# EasyEDA Pro project coreboards.mod001.rp2040.v01.eprj

# Schematic coreboards.mod001.rp2040.v01
Board Name: coreboards.mod001.rp2040.v01; Create Date: 2026-03-10; Page Name: coreboard; Project Name: coreboards.mod001.rp2040.v01; Schematic Name: coreboards.mod001.rp2040.v01; Update Date: 2026-03-13; Company: EasyEDA.com; Page Size: A4; Version: V1.0
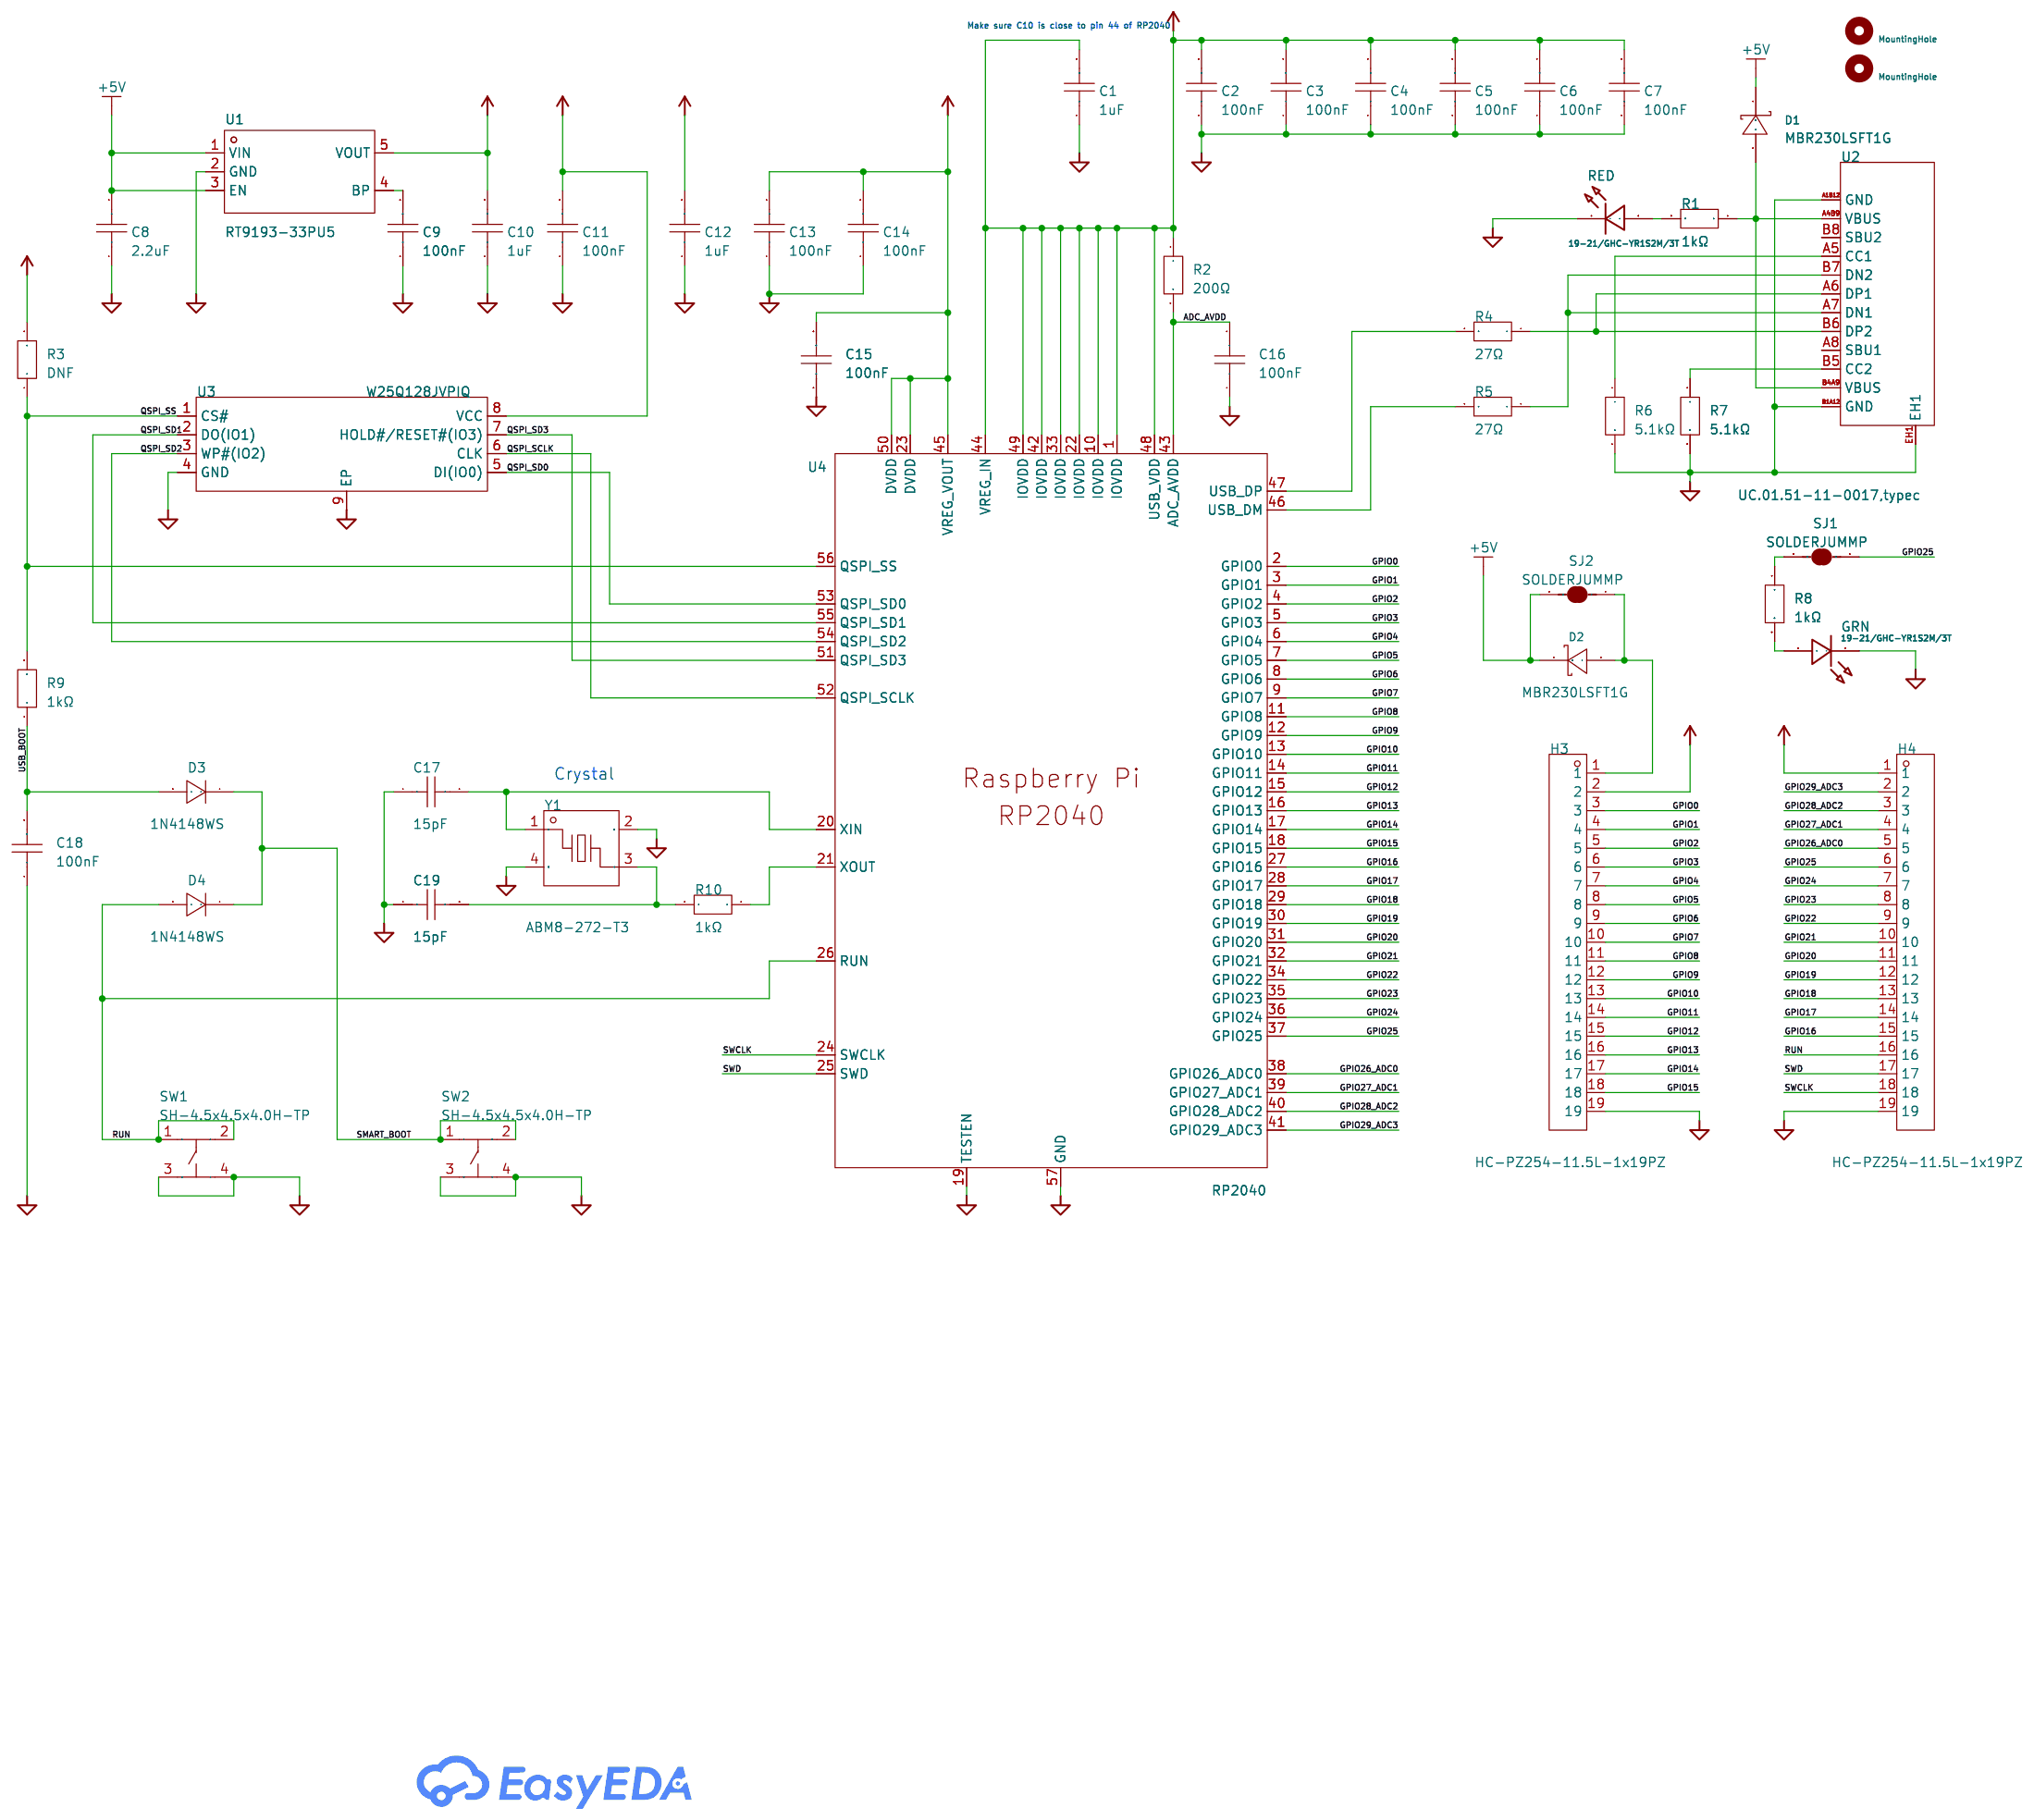
[diagram p0: schematic sheet]

## Parts
C1  1uF  [C0603]
C2  100nF  [C0603]
C3  100nF  [C0603]
C4  100nF  [C0603]
C5  100nF  [C0603]
C6  100nF  [C0603]
C7  100nF  [C0603]
C8  2.2uF  [C0603]
C9  100nF  [C0603]
C10  1uF  [C0603]
C11  100nF  [C0603]
C12  1uF  [C0603]
C13  100nF  [C0603]
C14  100nF  [C0603]
C15  100nF  [C0603]
C16  100nF  [C0603]
C17  15pF  [C0603]
C18  100nF  [C0603]
C19  15pF  [C0603]
D1  MBR230LSFT1G  [SOD-123FL_L2.7-W1.8-LS3.8-RD]
D2  MBR230LSFT1G  [SOD-123FL_L2.7-W1.8-LS3.8-RD]
D3  1N4148WS  [SOD-323_L1.8-W1.3-LS2.5-RD]
D4  1N4148WS  [SOD-323_L1.8-W1.3-LS2.5-RD]
GRN  19-21/GHC-YR1S2M/3T  [LED-SMD_L1.6-W0.8-RD]
H1  MountingHole  [MountingHole:MountingHole_2.7mm_M2.5]
H2  MountingHole  [MountingHole:MountingHole_2.7mm_M2.5]
H3  HC-PZ254-11.5L-1x19PZ  [HDR-TH_19P-P2.54-V-M]
H4  HC-PZ254-11.5L-1x19PZ  [HDR-TH_19P-P2.54-V-M]
R1  1kΩ  [R0603]
R2  200Ω  [R0603]
R3  DNF  [R0603]
R4  27Ω  [R0603]
R5  27Ω  [R0603]
R6  5.1kΩ  [R0603]
R7  5.1kΩ  [R0603]
R8  1kΩ  [R0603]
R9  1kΩ  [R0603]
R10  1kΩ  [R0603]
RED  19-21/GHC-YR1S2M/3T  [LED-SMD_L1.6-W0.8-RD]
SJ1  SOLDERJUMMP  [SJ_2S-NO]
SJ2  SOLDERJUMMP  [SJ_2S-NO]
SW1  SH-4.5x4.5x4.0H-TP  [SW-SMD_4P-SH-4.5X4.5X4.0H-TP]
SW2  SH-4.5x4.5x4.0H-TP  [SW-SMD_4P-SH-4.5X4.5X4.0H-TP]
U1  RT9193-33PU5  [SC-70-5_L2.0-W1.3-P0.65-LS2.1-BL]
U2  UC.01.51-11-0017,typec  [TYPE-C-SMD_UC.01.51-11-0017]
U3  W25Q128JVPIQ  [WSON-8_L5.0-W6.0-P1.27-BL-EP]
U4  RP2040  [QFN-56_L7.0-W7.0-P0.40-TL-EP4.0]
Y1  ABM8-272-T3  [CRYSTAL-SMD_4P-L3.2-W2.5-BL-2]

## Library data of the parts
C1-C19 = C0603C102J2GECAUTO: LCSC Part Name: 1nF ±5% 200V; Supplier Part: C2169812; Manufacturer: KEMET(基美); Supplier Footprint: 0603; JLCPCB Part Class: Extended Part; Datasheet: https://item.szlcsc.com/datasheet/C0603C102J2GECAUTO/2261877.html; Supplier: LCSC; Tolerance: ±5%; Voltage Rating: 200V; Temperature Coefficient: C0G
D1 D2 = MBR230LSFT1G: LCSC Part Name: 电压:30V 电流:2A; Supplier Part: C126673; Manufacturer: onsemi(安森美); Supplier Footprint: SOD-123FL; JLCPCB Part Class: Extended Part; Datasheet: https://item.szlcsc.com/datasheet/MBR230LSFT1G/137953.html; Supplier: LCSC; Voltage - Forward(Vf@If): 430mV@2A; Voltage - DC Reverse(Vr): 30V; Current - Rectified: 2A; Reverse Leakage Current (Ir): 1mA@30V; Operating Junction Temperature Range: -55℃~+125℃; Non-Repetitive Peak Forward Surge Current: 40A
D3 D4 = 1N4148WS_C2128: LCSC Part Name: 丝印T4 1N4148WS; Supplier Part: C2128; Manufacturer: CJ(江苏长电/长晶); Supplier Footprint: SOD-323; JLCPCB Part Class: Basic Part; Datasheet: https://item.szlcsc.com/datasheet/1N4148WS/2485.html; Supplier: LCSC; Diode Configuration: Independent; Voltage - Forward(Vf@If): 1.25V@150mA; Voltage - DC Reverse(Vr): 100V; Current - Rectified: 150mA; Pd - Power Dissipation: 200mW; Reverse Leakage Current (Ir): 1uA@75V; Reverse Recovery Time (trr): 4ns; Non-Repetitive Peak Forward Surge Current: 2A
GRN RED = 19-21/GHC-YR1S2M/3T: Supplier: LCSC; Supplier Part: C605453; Manufacturer: EVERLIGHT(亿光); JLCPCB Part Class: Extended Part; Contributor: LCSC; spicePre: L
H1 = Mechanical_MountingHole: Attribute1: H2
H2 = Mechanical_MountingHole
H3 H4 = HC-PZ254-11.5L-1x19PZ: LCSC Part Name: 1x19P 间距:2.54mm 方针 直插; Supplier Part: C27985198; Manufacturer: HC(虹成电子); Supplier Footprint: 插件,P=2.54mm; JLCPCB Part Class: Extended Part; Datasheet: https://item.szlcsc.com/datasheet/HC-PZ254-11.5L-1x19PZ/29721156.html; Supplier: LCSC; Pin Structure: 1x19P; Pitch: 2.54mm; Circluar Pins/Square Pins: Pin Header; Mounting Type: Through Hole; Number of Rows: 1; Number of Pins: 19P; Current Rating: 3A; Length of Mating Pin: 6mm; Insulation Height: 2.5mm; Length of End Connection Pin: 3mm; Contact Material: Brass; Contact Plating: Gold; Operating Temperature: -40℃~+105℃; Color: Black
R1-R10 = RCC06031K50FKEA: LCSC Part Name: 厚膜电阻 1.5kΩ ±1% 200mW; Supplier Part: C4303195; Manufacturer: VISHAY(威世); Supplier Footprint: 0603; JLCPCB Part Class: Extended Part; Datasheet: https://item.szlcsc.com/datasheet/RCC06031K50FKEA/4873636.html; Supplier: LCSC; Type: Thick Film Resistor; Tolerance: ±1%; Power(Watts): 200mW; Temperature Coefficient: ±100ppm/℃; Operating Temperature: -55℃~+155℃
SJ1 SJ2 = SOLDERJUMPERNO: Contributor: SparkFun; spicePre: S
SW1 SW2 = SH-4.5x4.5x4.0H-TP: LCSC Part Name: TS4540TP 250gf编带; Supplier Part: C52092029; Manufacturer: SHOU HAN(首韩); Supplier Footprint: SMD; JLCPCB Part Class: Extended Part; Datasheet: https://item.szlcsc.com/datasheet/SH-4.5x4.5x4.0H-TP/54864053.html; Supplier: LCSC
U1 = RT9193-33PU5: Supplier Part: C23384; Supplier Footprint: SC-70-5; JLCPCB Part Class: Extended Part; Supplier: LCSC
U2 = UC.01.51-11-0017,typec: Supplier Part: C9900066641; Supplier Footprint: usb-c-smd_type-c-6pin; JLCPCB Part Class: Extended Part; Supplier: LCSC
U3 = W25Q128JVPIQ_C2803379: LCSC Part Name: 支持双路/四路SPI接口的3V、128Mbit 串行闪存; Supplier Part: C2803379; Manufacturer: Winbond(华邦); Supplier Footprint: WSON-8-EP(5x6); JLCPCB Part Class: Extended Part; Datasheet: https://item.szlcsc.com/datasheet/W25Q128JVPIQ/2946213.html; Supplier: LCSC; Interface: SPI; Memory Size: 128Mbit; Clock Frequency: 133MHz; Voltage - Supply: 2.7V~3.6V; Program / Erase Cycles: 100,000 Cycles; Page Programming Time (Tpp): 400us; Block Erase Time(tBE): 120ms@(32KB); Data Retention - TDR (Year): 20 Years; Operating Temperature: -40℃~+85℃
U4 = RP2040: Supplier Part: C2961140; Manufacturer: Raspberry Pi(树莓派); Supplier Footprint: QFN-56-EP(7x7); JLCPCB Part Class: Extended Part; Datasheet: https://atta.szlcsc.com/upload/public/pdf/source/20220208/8D54DD1C91A7987165C42A5C4D6BB336.pdf; Supplier: LCSC
Y1 = ABM8-272-T3: Supplier Part: C9900091606; Supplier Footprint: SMD; Supplier: LCSC

## Nets
+5V: C8.2 D1.1(C) D2.1(C) SJ2.2 U1.1(VIN) U1.3(EN)
ADC_AVDD: C16.2 R2.2 U4.43(ADC_AVDD)
GPIO0: H3.3 U4.2(GPIO0)
GPIO1: H3.4 U4.3(GPIO1)
GPIO2: H3.5 U4.4(GPIO2)
GPIO3: H3.6 U4.5(GPIO3)
GPIO4: H3.7 U4.6(GPIO4)
GPIO5: H3.8 U4.7(GPIO5)
GPIO6: H3.9 U4.8(GPIO6)
GPIO7: H3.10 U4.9(GPIO7)
GPIO8: H3.11 U4.11(GPIO8)
GPIO9: H3.12 U4.12(GPIO9)
GPIO10: H3.13 U4.13(GPIO10)
GPIO11: H3.14 U4.14(GPIO11)
GPIO12: H3.15 U4.15(GPIO12)
GPIO13: H3.16 U4.16(GPIO13)
GPIO14: H3.17 U4.17(GPIO14)
GPIO15: H3.18 U4.18(GPIO15)
GPIO16: H4.15 U4.27(GPIO16)
GPIO17: H4.14 U4.28(GPIO17)
GPIO18: H4.13 U4.29(GPIO18)
GPIO19: H4.12 U4.30(GPIO19)
GPIO20: H4.11 U4.31(GPIO20)
GPIO21: H4.10 U4.32(GPIO21)
GPIO22: H4.9 U4.34(GPIO22)
GPIO23: H4.8 U4.35(GPIO23)
GPIO24: H4.7 U4.36(GPIO24)
GPIO25: H4.6 SJ1.1 U4.37(GPIO25)
GPIO26_ADC0: H4.5 U4.38(GPIO26_ADC0)
GPIO27_ADC1: H4.4 U4.39(GPIO27_ADC1)
GPIO28_ADC2: H4.3 U4.40(GPIO28_ADC2)
GPIO29_ADC3: H4.2 U4.41(GPIO29_ADC3)
POWER_+1V1: C13.2 C14.2 C15.2 U4.23(DVDD) U4.45(VREG_VOUT) U4.50(DVDD)
POWER_+3V3: C1.2 C2.2 C3.2 C4.2 C5.2 C6.2 C7.2 C10.2 C11.2 C12.2 H3.2 H4.1 R2.1 R3.2 U1.5(VOUT) U3.8(VCC) U4.1(IOVDD) U4.10(IOVDD) U4.22(IOVDD) U4.33(IOVDD) U4.42(IOVDD) U4.44(VREG_IN) U4.48(USB_VDD) U4.49(IOVDD)
POWER_GND: C1.1 C2.1 C3.1 C4.1 C5.1 C6.1 C7.1 C8.1 C9.1 C10.1 C11.1 C12.1 C13.1 C14.1 C15.1 C16.1 C17.1 C18.1 C19.1 GRN.1(-) H3.19 H4.19 R6.2 R7.2 RED.1(-) SW1.3 SW1.4 SW2.3 SW2.4 U1.2(GND) U2.A1B12(GND) U2.B1A12(GND) U2.EH1 U3.4(GND) U3.9(EP) U4.19(TESTEN) U4.57(GND) Y1.2(GND) Y1.4(GND)
QSPI_SCLK: U3.6(CLK) U4.52(QSPI_SCLK)
QSPI_SD0: U3.5(DI(IO0)) U4.53(QSPI_SD0)
QSPI_SD1: U3.2(DO(IO1)) U4.55(QSPI_SD1)
QSPI_SD2: U3.3(WP#(IO2)) U4.54(QSPI_SD2)
QSPI_SD3: U3.7(HOLD#/RESET#(IO3)) U4.51(QSPI_SD3)
QSPI_SS: R3.1 R9.2 U3.1(CS#) U4.56(QSPI_SS)
RUN: D4.2(A) H4.16 SW1.1 SW1.2 U4.26(RUN)
SMART_BOOT: D3.1(K) D4.1(K) SW2.1 SW2.2
SWCLK: H4.18 U4.24(SWCLK)
SWD: H4.17 U4.25(SWD)
USB_BOOT: C18.2 D3.2(A) R9.1
$1N452: R4.2 U4.47(USB_DP)
$1N453: R5.2 U4.46(USB_DM)
$1N454: R4.1 U2.A6(DP1) U2.B6(DP2)
$1N455: R5.1 U2.A7(DN1) U2.B7(DN2)
$1N456: D1.2(A) R1.1 U2.A4B9(VBUS) U2.B4A9(VBUS)
$1N458: R6.1 U2.A5(CC1)
$1N459: R7.1 U2.B5(CC2)
$1N1604: C19.2 R10.2 Y1.3
$1N1613: R10.1 U4.21(XOUT)
$1N2950: C9.2 U1.4(BP)
$1N6481: D2.2(A) H3.1 SJ2.1
$1N8578: R1.2 RED.2(+)
$1N8767: R8.1 SJ1.2
$1N8801: GRN.2(+) R8.2
$1N10436: C17.2 U4.20(XIN) Y1.1

Not connected (* = marked no-connect by the designer): U2 A8(SBU1) B8(SBU2)

## Notes on the sheet
- Make sure C10 is close to pin 44 of RP2040
- Crystal

# Board coreboards.mod001.rp2040.v01
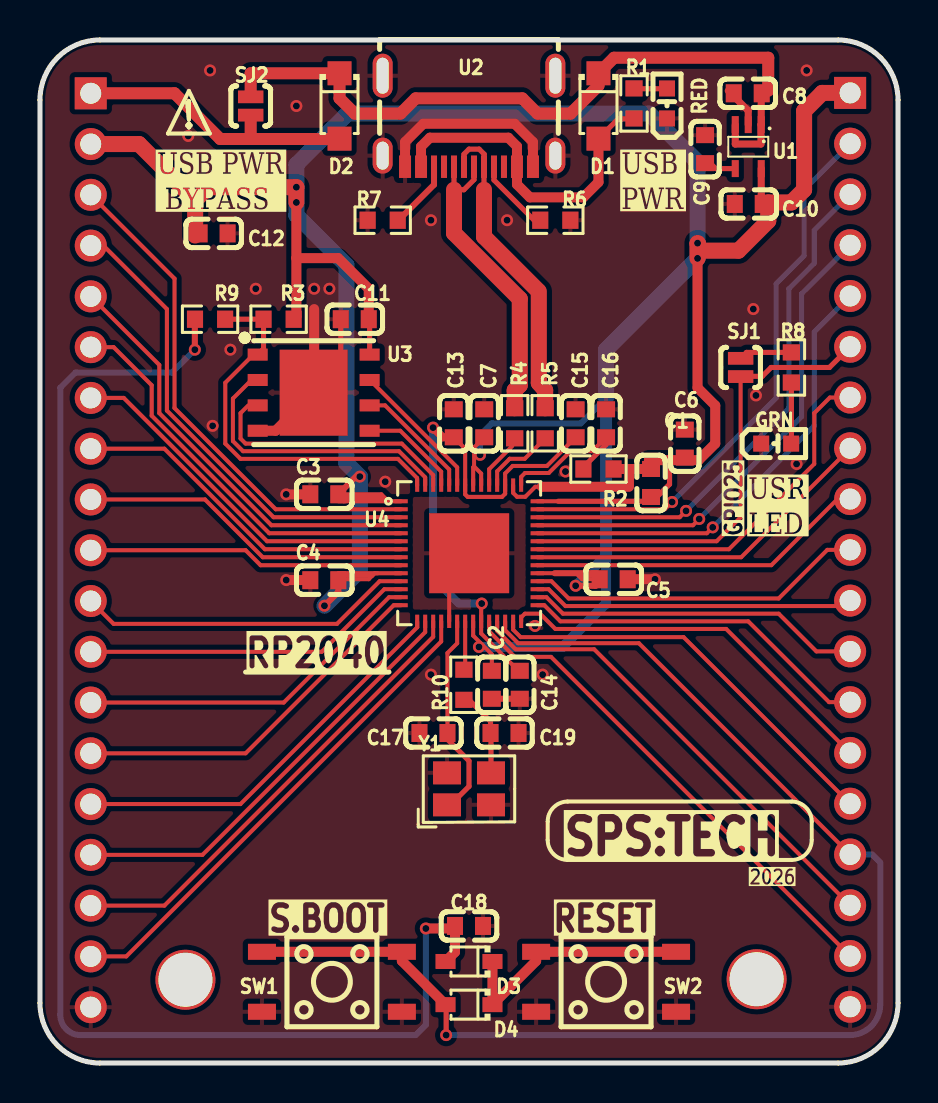
[diagram p1: board, top side]
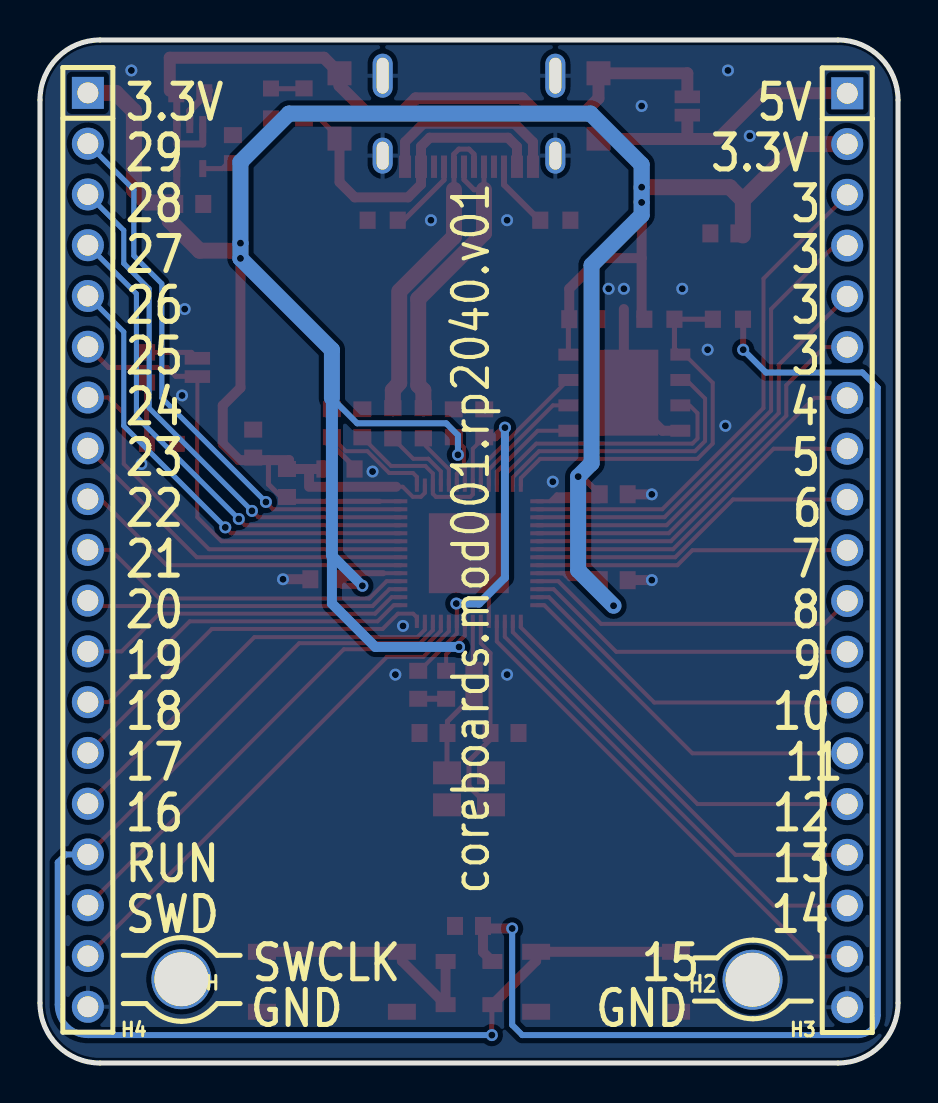
[diagram p2: board, bottom side, seen from below]

Outline 42.93 x 51.18 mm; copper layers: Top Layer, Bottom Layer. Coordinates in mm from the lower left corner of the outline.
Outline path: 0,48.18 0,3 arc(0.88,0.88) 3,0 39.93,0 arc(42.05,0.88) 42.93,3 42.93,48.18 arc(42.05,50.3) 39.93,51.18 3,51.18 arc(0.88,50.3) 0,48.18
Stack: Top Layer 0.035mm / Dielectric1 1.51mm FR4 er 4.5 / Bottom Layer 0.035mm

## Design rules (mm)
template: JLCPCB Capability(Two Layers Board)
spacing copperThickness1oz (default): track to track 0.102, other pairs 0.152 to 0.3
spacing copperThickness2oz: track to track 0.203, other pairs 0.152 to 0.3
track width copperThickness1oz (default): min 0.127, default 0.254, max 2.54
track width copperThickness2oz: min 0.203, default 0.254, max 2.54
differential pair differentialPair (default): width min 0.127, default 0.254, max 2.54; gap min 0.152, default 0.152
via viaSize (default): diameter min 0.5, default 0.61, max 10; hole min 0.3, default 0.305, max 6.3

## Placement (name value [footprint] x y rotation side)
C1  1uF  [C0603]  30.57 29.02 270 top
C2  100nF  [C0603]  22.61 18.92 90 top
C3  100nF  [C0603]  14.22 28.45 0 top
C4  100nF  [C0603]  14.22 24.15 0 top
C5  100nF  [C0603]  28.7 24.2 180 top
C6  100nF  [C0603]  32.26 30.99 270 top
C7  100nF  [C0603]  22.22 32 270 top
C8  2.2uF  [C0603]  35.41 48.51 180 top
C9  100nF  [C0603]  33.27 45.72 270 top
C10  1uF  [C0603]  35.46 42.98 0 top
C11  100nF  [C0603]  15.75 37.21 0 top
C12  1uF  [C0603]  8.69 41.5 180 top
C13  100nF  [C0603]  20.7 32 270 top
C14  100nF  [C0603]  24 18.92 90 top
C15  100nF  [C0603]  26.8 32 270 top
C16  100nF  [C0603]  28.32 32 270 top
C17  15pF  [C0603]  19.69 16.51 0 top
C18  100nF  [C0603]  21.46 6.86 180 top
C19  15pF  [C0603]  23.24 16.51 180 top
D1  MBR230LSFT1G  [SOD-123FL_L2.7-W1.8-LS3.8-RD]  27.94 47.88 270 top
D2  MBR230LSFT1G  [SOD-123FL_L2.7-W1.8-LS3.8-RD]  14.99 47.88 270 top
D3  1N4148WS  [SOD-323_L1.8-W1.3-LS2.5-RD]  21.46 5.08 180 top
D4  1N4148WS  [SOD-323_L1.8-W1.3-LS2.5-RD]  21.46 2.92 180 top
GRN  19-21/GHC-YR1S2M/3T  [LED-SMD_L1.6-W0.8-RD]  36.83 30.99 0 top
H1  MountingHole  [MountingHole:MountingHole_2.7mm_M2.5]  35.85 4.19 0 top
H2  MountingHole  [MountingHole:MountingHole_2.7mm_M2.5]  7.28 4.17 0 top
H3  HC-PZ254-11.5L-1x19PZ  [HDR-TH_19P-P2.54-V-M]  2.54 25.65 270 bottom
H4  HC-PZ254-11.5L-1x19PZ  [HDR-TH_19P-P2.54-V-M]  40.53 25.67 270 bottom
R1  1kΩ  [R0603]  29.72 48.01 90 top
R2  200Ω  [R0603]  27.94 29.72 180 top
R3  DNF  [R0603]  11.94 37.21 0 top
R4  27Ω  [R0603]  23.75 32 270 top
R5  27Ω  [R0603]  25.27 32 270 top
R6  5.1kΩ  [R0603]  25.78 42.16 0 top
R7  5.1kΩ  [R0603]  17.15 42.16 180 top
R8  1kΩ  [R0603]  37.59 34.8 270 top
R9  1kΩ  [R0603]  8.51 37.21 0 top
R10  1kΩ  [R0603]  21.21 18.92 270 top
RED  19-21/GHC-YR1S2M/3T  [LED-SMD_L1.6-W0.8-RD]  31.37 48.01 90 top
SJ1  SOLDERJUMMP  [SJ_2S-NO]  35.05 34.8 90 top
SJ2  SOLDERJUMMP  [SJ_2S-NO]  10.54 47.88 90 top
SW1  SH-4.5x4.5x4.0H-TP  [SW-SMD_4P-SH-4.5X4.5X4.0H-TP]  14.6 4.06 0 top
SW2  SH-4.5x4.5x4.0H-TP  [SW-SMD_4P-SH-4.5X4.5X4.0H-TP]  28.32 4.06 0 top
U1  RT9193-33PU5  [SC-70-5_L2.0-W1.3-P0.65-LS2.1-BL]  35.43 45.85 180 top
U2  UC.01.51-11-0017,typec  [TYPE-C-SMD_UC.01.51-11-0017]  21.46 47.12 180 top
U3  W25Q128JVPIQ  [WSON-8_L5.0-W6.0-P1.27-BL-EP]  13.69 33.54 270 top
U4  RP2040  [QFN-56_L7.0-W7.0-P0.40-TL-EP4.0]  21.47 25.5 0 top
Y1  ABM8-272-T3  [CRYSTAL-SMD_4P-L3.2-W2.5-BL-2]  21.46 13.72 0 top

## Footprints (pads in the part's own frame, mm; a bottom-side part is the same pattern mirrored in y, then rotated)
C0603
  rect 0.8x0.9 smd: 1(-0.7,0) 2(0.7,0)
CRYSTAL-SMD_4P-L3.2-W2.5-BL-2
  rect 1.4x1.15 smd: 1(-1.1,-0.8) 2(1.1,-0.8) 3(1.1,0.8) 4(-1.1,0.8)
HDR-TH_19P-P2.54-V-M
  rect 1.6x1.6 hole 1.05: 1(-22.86,0)
  round 1.6 hole 1.05: 2(-20.32,0) 3(-17.78,0) 4(-15.24,0) 5(-12.7,0) 6(-10.16,0) 7(-7.62,0) 8(-5.08,0) 9(-2.54,0) 10(0,0) 11(2.54,0) 12(5.08,0) 13(7.62,0) 14(10.16,0) 15(12.7,0) 16(15.24,0) 17(17.78,0) 18(20.32,0) 19(22.86,0)
LED-SMD_L1.6-W0.8-RD
  rect 0.8x0.8 smd: 1(-0.75,0) 2(0.75,0)
MountingHole:MountingHole_2.7mm_M2.5
  round 3 hole 2.7: (0,0)
QFN-56_L7.0-W7.0-P0.40-TL-EP4.0
  rect 0.665x0.2 smd: 1(-3.408,2.6) 2(-3.408,2.2) 3(-3.408,1.8) 4(-3.408,1.4) 5(-3.408,1) 6(-3.408,0.6) 7(-3.408,0.2) 8(-3.408,-0.2) 9(-3.408,-0.6) 10(-3.408,-1) 11(-3.408,-1.4) 12(-3.408,-1.8) 13(-3.408,-2.2) 14(-3.408,-2.6) 29(3.408,-2.6) 30(3.408,-2.2) 31(3.408,-1.8) 32(3.408,-1.4) 33(3.408,-1) 34(3.408,-0.6) 35(3.408,-0.2) 36(3.408,0.2) 37(3.408,0.6) 38(3.408,1) 39(3.408,1.4) 40(3.408,1.8) 41(3.408,2.2) 42(3.408,2.6)
  rect 0.2x0.665 smd: 15(-2.6,-3.408) 16(-2.2,-3.408) 17(-1.8,-3.408) 18(-1.4,-3.408) 19(-1,-3.408) 20(-0.6,-3.408) 21(-0.2,-3.408) 22(0.2,-3.408) 23(0.6,-3.408) 24(1,-3.408) 25(1.4,-3.408) 26(1.8,-3.408) 27(2.2,-3.408) 28(2.6,-3.408) 43(2.6,3.408) 44(2.2,3.408) 45(1.8,3.408) 46(1.4,3.408) 47(1,3.408) 48(0.6,3.408) 49(0.2,3.408) 50(-0.2,3.408) 51(-0.6,3.408) 52(-1,3.408) 53(-1.4,3.408) 54(-1.8,3.408) 55(-2.2,3.408) 56(-2.6,3.408)
  rect 4x4 smd: 57(0,0)
R0603
  rect 0.806x0.864 smd: 1(-0.753,0) 2(0.753,0)
SC-70-5_L2.0-W1.3-P0.65-LS2.1-BL
  rect 0.35x0.85 smd: 1(-0.65,-1.1) 2(0,-1.1) 3(0.65,-1.1) 4(0.65,1.1) 5(-0.65,1.1)
SJ_2S-NO
  rect 0.635x1.27 smd: 1(-0.457,0) 2(0.457,0)
SOD-123FL_L2.7-W1.8-LS3.8-RD
  rect 1.2x1.2 smd: 1(-1.635,0) 2(1.635,0)
SOD-323_L1.8-W1.3-LS2.5-RD
  rect 1x0.75 smd: 1(-1.173,0) 2(1.173,0)
SW-SMD_4P-SH-4.5X4.5X4.0H-TP
  rect 1.4x0.8 smd: 1(-3.5,1.5) 2(3.5,1.5) 3(-3.5,-1.5) 4(3.5,-1.5)
TYPE-C-SMD_UC.01.51-11-0017
  rect 0.6x1.12 smd: A1B12(-3.2,2.277) A4B9(-2.4,2.277) B1A12(3.2,2.277) B4A9(2.4,2.277)
  rect 0.3x1.12 smd: A5(-1.25,2.277) A6(-0.25,2.277) A7(0.25,2.277) A8(1.25,2.277) B5(1.75,2.277) B6(0.75,2.277) B7(-0.75,2.277) B8(-1.75,2.277)
  oval 1x1.8 hole 0.6x1.4: EH1(-4.32,1.722) EH1(4.32,1.722)
  oval 1x2.2 hole 0.6x1.8: EH1(-4.32,-2.277) EH1(4.32,-2.277)
WSON-8_L5.0-W6.0-P1.27-BL-EP
  rect 0.6x1 smd: 1(-1.905,-2.8) 2(-0.635,-2.8) 3(0.635,-2.8) 4(1.905,-2.8) 5(1.905,2.8) 6(0.635,2.8) 7(-0.635,2.8) 8(-1.905,2.8)
  rect 4.3x3.4 smd: 9(0,0)

## Nets
As in the schematic.

Pads without a net: U2 A8 B8

## Via types
v1: diameter 0.6, hole 0.35, Top Layer to Bottom Layer, 40 vias

## Routing (per net, layer and track width the routed paths; a pad name or vN(x,y) marks a point on that pad's centre or on a via; arc(x,y) is an arc through that point)
+5V: length 37.7
  Top Layer w0.35: 36.43,48.64 36.08,48.64 U1.1 36.07,46.95 36.07,45.97 34.78,45.97 U1.3
  Top Layer w0.6: SJ2.2 10.54,49.51 D2.1 14.99,48.26 15.75,47.5 18.03,47.5 18.8,48.26 24.13,48.26 24.89,47.5 26.54,47.5 27.94,48.89 D1.1 28.72,50.29 36.43,50.29 36.43,48.64
ADC_AVDD: length 7.5
  Top Layer w0.2: U4.43 24.07,29.32 24.26,29.52 25.45,29.52 26.54,30.61 27.62,30.61 C16.2
  Top Layer w0.254: C16.2 28.32,30.94 27.19,29.81 R2.2
GPIO0: length 25.8
  Top Layer w0.203: H3.3 6.73,39.24 6.73,32.77 11.79,27.7 U4.2
GPIO1: length 24.1
  Top Layer w0.203: 18.06,27.3 11.68,27.3 6.35,32.64 6.35,37.72 3.18,40.89 H3.4
GPIO2: length 21.7
  Top Layer w0.203: H3.5 5.97,34.92 5.97,32.51 11.58,26.9 U4.4
GPIO3: length 20.3
  Top Layer w0.203: U4.5 11.47,26.5 5.59,32.38 5.59,33.91 3.68,35.81 H3.6
GPIO4: length 18.5
  Top Layer w0.203: H3.7 4.19,33.27 11.36,26.1 U4.6
GPIO5: length 17.6
  Top Layer w0.203: U4.7 11.25,25.7 6.22,30.73 H3.8
GPIO6: length 16.7
  Top Layer w0.203: H3.9 8.25,28.19 11.15,25.3 U4.8
GPIO7: length 15.8
  Top Layer w0.203: U4.9 11.04,24.9 10.29,25.65 H3.10
GPIO8: length 16.9
  Top Layer w0.2: H3.11 3.68,21.97 14.86,21.97 16.99,24.1 U4.11
GPIO9: length 16.8
  Top Layer w0.2: U4.12 17.23,23.7 14.1,20.57 H3.12
GPIO10: length 17.7
  Top Layer w0.2: U4.13 17.46,23.3 12.19,18.03 H3.13
GPIO11: length 18.6
  Top Layer w0.2: H3.14 10.29,15.49 17.7,22.9 U4.14
GPIO12: length 20.3
  Top Layer w0.2: U4.15 18.87,21.8 10.03,12.95 H3.15
GPIO13: length 21.9
  Top Layer w0.2: U4.16 19.27,21.56 8.13,10.41 H3.16
GPIO14: length 23.5
  Top Layer w0.2: H3.17 6.22,7.87 19.67,21.32 U4.17
GPIO15: length 25.1
  Top Layer w0.2: U4.18 20.07,21.09 4.32,5.33 H3.18
GPIO16: length 20.9
  Top Layer w0.2: H4.15 32.2,21.3 24.05,21.3 23.67,21.68 U4.27
GPIO17: length 19.6
  Top Layer w0.2: H4.14 34.33,21.72 25.78,21.72 25.02,22.48 24.26,22.48 24.07,22.29 U4.28
GPIO18: length 17.7
  Top Layer w0.2: H4.13 39.48,18.05 35.43,22.1 26.03,22.1 25.23,22.9 U4.29
GPIO19: length 16.8
  Top Layer w0.2: H4.12 38.84,20.59 36.96,22.48 26.16,22.48 25.34,23.3 U4.30
GPIO20: length 16.1
  Top Layer w0.2: U4.31 25.45,23.7 26.29,22.86 40.26,22.86 H4.11
GPIO21: length 17
  Top Layer w0.2: U4.32 25.59,24.1 26.45,23.24 36.96,23.24 39.39,25.67 H4.10
GPIO22: length 17
  Top Layer w0.2: U4.34 24.88,24.91 36.59,24.91 39.9,28.21 H4.9
GPIO23: length 17.9
  Top Layer w0.2: H4.8 35.08,25.3 U4.35
GPIO24: length 20.3
  Top Layer w0.2: U4.36 34.47,25.7 38.74,29.97 38.74,32.51 39.52,33.29 H4.7
GPIO25: length 23.8
  Top Layer w0.2: U4.37 33.85,26.1 35.05,27.3 SJ1.1
  Top Layer w0.254: H4.6 39.5,34.8 36.58,34.8 36.13,34.35 35.06,34.35 SJ1.1
GPIO26_ADC0: length 23.3
  Top Layer w0.2: v1(33.66,26.8) 33.36,26.5 U4.38
  Bottom Layer w0.254: H4.5 38.74,36.58 38.74,31.88 v1(33.66,26.8)
GPIO27_ADC1: length 25.1
  Top Layer w0.2: v1(32.98,27.22) 32.67,26.9 U4.39
  Bottom Layer w0.254: H4.4 38.1,38.48 38.1,32.34 v1(32.98,27.22)
GPIO28_ADC2: length 26.8
  Top Layer w0.2: v1(32.32,27.62) 32,27.3 U4.40
  Bottom Layer w0.254: v1(32.32,27.62) 37.47,32.77 37.47,38.73 38.74,40 38.74,41.66 H4.3
GPIO29_ADC3: length 28.5
  Top Layer w0.2: v1(31.62,28.07) 31.26,27.7 U4.41
  Bottom Layer w0.254: v1(31.62,28.07) 36.83,33.27 36.83,38.99 38.23,40.39 38.23,43.69 40.53,45.99
POWER_+1V1: length 26.7
  Top Layer w0.2: C13.2 21.27,30.73 U4.50 ; C15.2 25.37,29.87 23.65,29.87 23.27,29.49 U4.45 ; 24.28,19.62 23.94,19.62 22.07,21.49 U4.23
  Top Layer w0.203: U4.45 23.27,28.48 23.11,28.32 21.4,28.32 21.27,28.45 U4.50 ; v1(22.1,22.99) 22.07,22.96 U4.23
  Top Layer w0.4: C13.2 20.15,31.3 v1(19.66,31.79)
  Bottom Layer w0.4: v1(19.66,31.79) 19.66,24.28 20.96,22.99 v1(22.1,22.99)
POWER_+3V3: length 210
  Top Layer w0.2: U4.1 14.92,28.1 ; 29.46,29.72 29.46,28.83 24.78,28.83 24.28,28.33 23.87,28.33 23.67,28.52 U4.44 ; U4.33 27.87,24.5 27.88,24.51 ; 31.5,28.96 30.64,28.1 U4.42 ; U4.48 22.07,29.49 21.72,29.84 21.72,30.8 C7.2 ; U4.22 21.67,21.38 22.61,20.45 22.61,19.88 22.86,19.62
  Top Layer w0.203: C4.2 14.97,24.2 16.44,24.2 16.62,24.38 ; 15.21,28.1 15.3,28.19 17.15,28.19 17.02,28.32 15.24,28.32 15.24,28.38 15.17,28.45 17.08,28.45 17.42,28.1 ; 16.62,24.38 15.37,24.38 15.25,24.5 14.93,24.5 U4.10 ; 16.62,24.38 16.74,24.5 16.9,24.5 ; 26.82,24.5 27.12,24.21 27.91,24.21 27.81,24.3 27.81,24.38 27.16,24.38 ; U4.49 21.67,29.8 21.72,29.84
  Top Layer w0.254: 25.93,28.1 30.64,28.1 31.5,28.96 31.5,30.16 ; C11.2 16.49,37.17 U3.8 ; R2.1 30.34,29.72
  Top Layer w0.3: 27.87,24.5 25.75,24.5 ; C4.2 14.92,23.57 v1(14.23,22.88) ; C3.2 15.81,29.34 v1(16,29.34) ; 28.13,24.2 27.8,23.88 v1(26.8,23.88)
  Top Layer w0.35: U1.5 36.08,43.4 36.43,43.05
  Top Layer w0.5: R2.1 30.48,29.72 ; 29.46,29.72 29.46,28.96 ; 29.46,28.83 25.11,28.83 ; R3.2 12.83,37.35 12.83,40.27 ; 30.46,29.84 30.46,30.16 32.96,30.16 33.78,30.99 33.78,32.89 32.9,33.78 v1(32.9,40.25) ; v1(12.83,43.05) 12.83,40.27 ; 12.83,40.27 14.91,40.27 16.45,38.73 C11.2
  Top Layer w0.8: 7.76,43.16 4.95,45.97 H3.2 ; 7.76,43.16 8.41,43.81 v1(12.83,43.81) v1(12.83,43.05) ; 7.76,43.16 7.76,41.4 ; 33.27,40.64 34.94,40.64 36.43,42.13 36.43,43.05 37.59,43.05 38.23,43.69 38.23,47.62 39.14,48.53 H4.1 ; v1(32.9,41.02) 32.91,41 32.9,40.99 v1(32.9,40.25)
  Bottom Layer w0.3: 28.32,33.27 27.06,32 22.61,32 22.02,31.41 v1(22.02,30.43)
  Bottom Layer w0.5: v1(21.96,20.82) 26.15,20.82 28.32,22.99 28.32,25.4 v1(26.8,23.88)
  Bottom Layer w0.6: 28.32,33.27 28.32,25.4
  Bottom Layer w0.8: 28.32,33.27 28.32,35.68 v1(32.9,40.25) v1(32.9,41.02) 32.9,45.07 30.47,47.5 15.38,47.5 12.83,44.95 v1(12.83,43.81) v1(12.83,43.05) 12.83,42.42 15.33,39.91 15.33,30.01 v1(16,29.34) 16,24.65 v1(14.23,22.88)
POWER_GND: length 32.6
  Top Layer w0.2: U4.19 20.47,24.5
  Top Layer w0.203: 20.47,26.5 U4.57
  Top Layer w0.254: C11.1 15.05,34.89 13.72,33.56
  Top Layer w0.3: 22.61,18.22 24,18.22
  Top Layer w0.35: U1.2 35.43,47.64 34.43,48.64
  Top Layer w0.5: 29.53,24.2 30.76,24.2 v1(30.77,24.2) ; U2.B1A12 18.26,46.08 19.18,46.99 23.75,46.99 24.66,46.08 24.66,44.84 ; C4.1 13.52,24.16 v1(12.32,24.16) ; 13.72,37.72 13.72,33.56 U3.9 11.79,31.63 U3.4 ; 13.52,28.36 13.43,28.45 v1(12.32,28.45)
  vias: v1(7.42,46.38) v1(8.51,49.66) v1(8.64,31.88) v1(9.53,35.69) v1(10.79,38.73) v1(12.83,47.88) v1(13.72,38.73) v1(14.48,38.73) v1(17.27,29.08) v1(19.56,42.16) v1(19.56,19.43) v1(23.37,42.16) v1(24.76,21.87) v1(25.15,19.43) v1(26.29,29.59) v1(35.69,37.72) v1(35.82,33.4) v1(37.85,29.97) v1(38.35,49.66)
QSPI_SCLK: length 6.1
  Top Layer w0.2: U3.6 17.26,32.9 20.47,29.69 U4.52
QSPI_SD0: length 5.1
  Top Layer w0.2: U3.5 18.03,31.63 20.07,29.59 U4.53
QSPI_SD1: length 14.5
  Top Layer w0.2: U3.2 10.58,34.17 9.65,33.24 9.65,31.11 10.16,30.61 17.96,30.61 19.27,29.3 U4.55
QSPI_SD2: length 12.7
  Top Layer w0.2: U4.54 19.67,29.41 18.1,30.99 10.29,30.99 10.03,31.24 10.03,32.51 10.41,32.89
QSPI_SD3: length 7.1
  Top Layer w0.2: U4.51 20.87,29.8 16.5,34.17 U3.7
QSPI_SS: length 19.7
  Top Layer w0.2: U3.1 10.68,35.44 9.27,34.04 9.27,30.99 10.03,30.23 17.91,30.23 18.87,29.27 18.87,28.92 U4.56
  Top Layer w0.254: R9.2 R3.1 11.18,35.73 U3.1
RUN: length 65.8
  Top Layer w0.2: U4.26 23.27,21.65 23.92,21 29.96,21 H4.16
  Top Layer w0.254: v1(20.32,1.4) 20.32,2.89
  Top Layer w0.5: SW1.1 SW1.2 18.1,5.11 D4.2
  Bottom Layer w0.3: H4.16 41.64,10.43 42.04,10.03 42.04,2.92 arc(41.59,1.84) 40.51,1.4 v1(20.32,1.4)
SMART_BOOT: length 12.7
  Top Layer w0.5: D3.1 D4.1 24.82,5.11 SW2.1 SW2.2
SWCLK: length 25.3
  Top Layer w0.2: U4.24 22.47,21.6 23.75,20.32 25.56,20.32 H4.18
SWD: length 23.8
  Top Layer w0.2: U4.25 22.87,21.62 23.79,20.7 27.72,20.7 H4.17
USB_BOOT: length 67.6
  Top Layer w0.3: R9.1 7.75,37.2 v1(7.75,35.69)
  Top Layer w0.5: v1(19.3,6.73) 20.76,6.73 20.76,5.55 D3.2
  Bottom Layer w0.3: v1(7.75,35.69) 6.6,34.54 1.78,34.54 1.02,33.78 1.02,2.41 arc(1.31,1.69) 2.03,1.4 18.8,1.4 19.3,1.91 v1(19.3,6.73)
$1N452: length 2.4
  Top Layer w0.2: U4.47 22.47,29.71 23.62,30.86
$1N453: length 3.8
  Top Layer w0.2: R5.2 24.25,30.23 23.5,30.23 23.5,30.23 23.5,30.23 22.87,29.6 U4.46
$1N454: length 15.4
  Top Layer w0.254: U2.A6 21.71,44.19 21.21,43.69 20.71,43.69 U2.B6
  Top Layer w0.8: 20.71,43.69 20.71,41.52 24,38.23 24,33.91 23.75,33.65 R4.1
$1N455: length 15.7
  Top Layer w0.254: 22.21,43.69 U2.B7 22.22,44.85 22.22,45.47 21.97,45.72 21.46,45.72 21.21,45.47 U2.A7
  Top Layer w0.8: 24.96,38.6 24.96,34.02 25.27,33.65 R5.1 ; 24.91,38.65 22.21,41.34 22.21,43.69
$1N456: length 16.8
  Top Layer w0.254: D1.2 28.93,47.24 29.72,47.24
  Top Layer w0.5: 27.94,45.99 27.94,44.07 27.18,43.31 24.51,43.31 23.86,43.95 U2.A4B9 23.86,45.86 23.43,46.29 19.51,46.29 19.06,45.85 U2.B4A9
$1N458: length 3.8
  Top Layer w0.254: 25.01,42.16 24.72,42.16 22.71,44.17 U2.A5
$1N459: length 3.4
  Top Layer w0.3: R7.1 17.94,42.16 19.71,43.94 U2.B5
$1N1604: length 3.9
  Top Layer w0.254: 21.46,18.17 22.54,17.09 22.54,16.51 22.56,16.49 22.56,14.69
$1N1613: length 2.5
  Top Layer w0.2: 21.46,19.68 21.27,19.87 U4.21
$1N2950: length 1.4
  Top Layer w0.254: 33.53,45.02 33.8,44.75 U1.4
$1N6481: length 14.6
  Top Layer w0.6: D2.2 14.97,46.23 10.49,46.23 ; 10.49,46.23 9.02,46.23 6.73,48.51 H3.1 ; 10.49,46.23 10.54,46.28 SJ2.1
$1N8578: length 1.7
  Top Layer w0.254: RED.2 31.35,48.74 29.72,48.74
$1N8767: length 2.7
  Top Layer w0.254: 35.05,35.25 35.35,35.55 R8.1
$1N8801: length 3.1
  Top Layer w0.254: GRN.2 37.59,31 R8.2
$1N10436: length 10.4
  Top Layer w0.2: C17.2 20.38,20.51 20.87,21 U4.20
  Top Layer w0.254: C17.2 20.38,16.19 21.46,15.11 21.46,13.84 20.62,12.99 20.36,12.99

## Copper pours and planes (outline as drawn; the poured copper is in the pictures)
POWER_GND on Top Layer: 0,51.18 43.43,51.18 43.43,-0.64 0,-0.64
POWER_GND on Bottom Layer: 0.13,51.05 43.43,51.05 43.43,-0.64 0.13,-0.64

## Text on the board
Bottom Silkscreen Layer: H2 | coreboards.mod001.rp2040.v01 | 6 | 9 | 3 | 5 | 7 | 8 | 4 | 11 | 10 | 12 | 13 | 14 | 5V | 3.3V | 15 | GND | SWCLK | 29 | 28 | 27 | 26 | 25 | 24 | 23 | 22 | 21 | 20 | 19 | 18 | 17 | 16 | RUN | SWD
Top Silkscreen Layer: 2026 | GPIO25 | S.BOOT | RESET | RP2040 | SPS:TECH | USB PWR / BYPASS | USB / PWR | USR / LED | ⚠
